# EAGLE design Sensor Acquisition Board Rev2 (EAGLE 9.6.2)
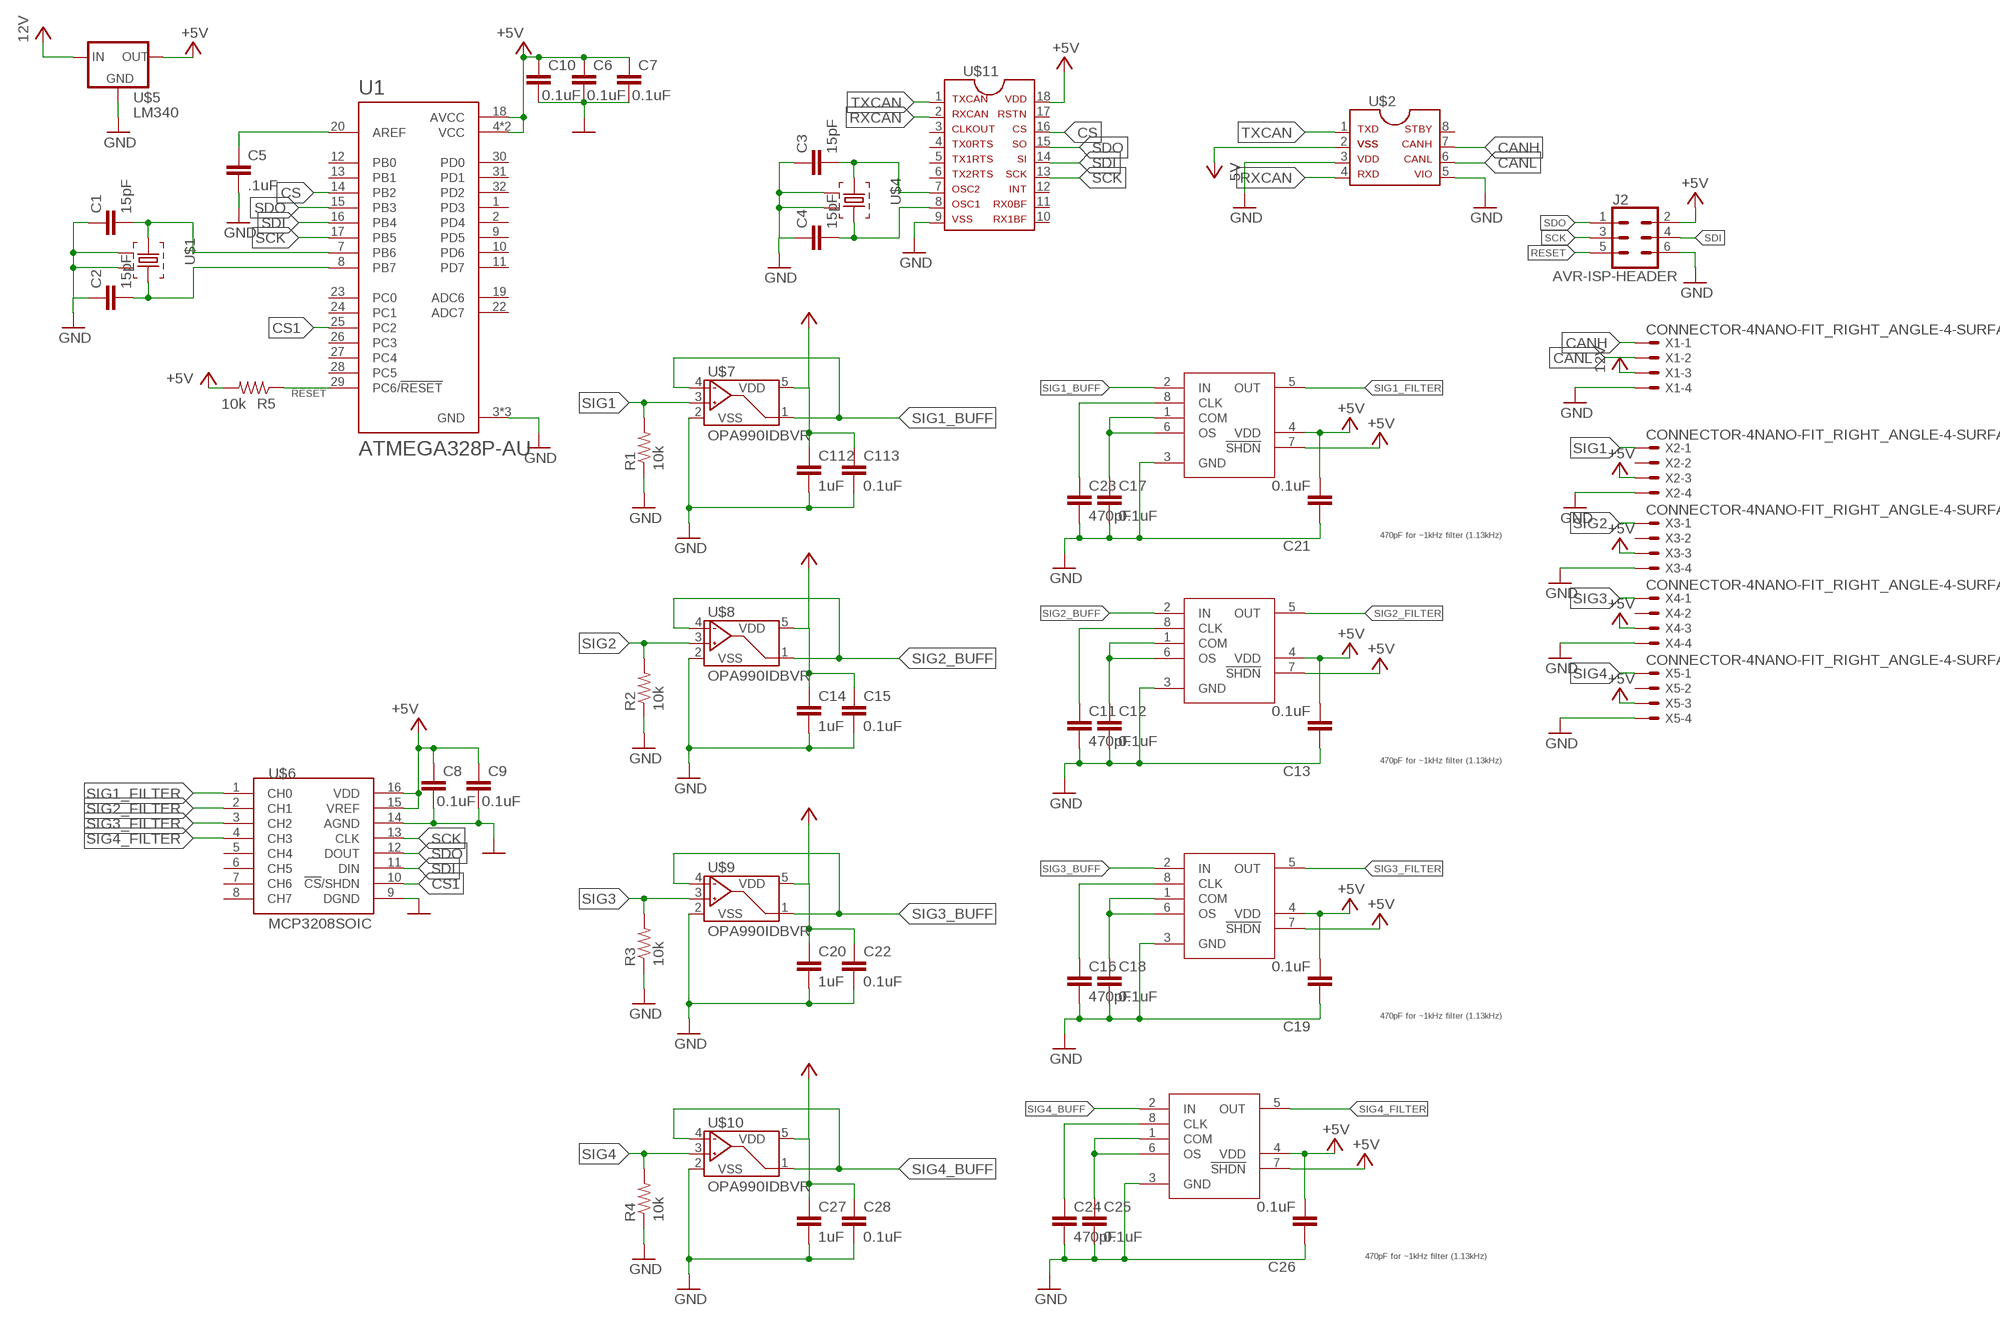
[diagram p0: schematic, sheet 1]

## Parts
C1  15pF  CAP0603-CAP  [0603-CAP]
C2  15pF  CAP0603-CAP  [0603-CAP]
C3  15pF  CAP0603-CAP  [0603-CAP]
C4  15pF  CAP0603-CAP  [0603-CAP]
C5  .1uF  CAP0603-CAP  [0603-CAP]
C6  0.1uF  CAP0603-CAP  [0603-CAP]
C7  0.1uF  CAP0603-CAP  [0603-CAP]
C8  0.1uF  CAP0603-CAP  [0603-CAP]
C9  0.1uF  CAP0603-CAP  [0603-CAP]
C10  0.1uF  CAP0603-CAP  [0603-CAP]
C11  470pF  CAP0603-CAP  [0603-CAP]
C12  0.1uF  CAP0603-CAP  [0603-CAP]
C13  0.1uF  CAP0603-CAP  [0603-CAP]
C14  1uF  CAP0603-CAP  [0603-CAP]
C15  0.1uF  CAP0603-CAP  [0603-CAP]
C16  470pF  CAP0603-CAP  [0603-CAP]
C17  0.1uF  CAP0603-CAP  [0603-CAP]
C18  0.1uF  CAP0603-CAP  [0603-CAP]
C19  0.1uF  CAP0603-CAP  [0603-CAP]
C20  1uF  CAP0603-CAP  [0603-CAP]
C21  0.1uF  CAP0603-CAP  [0603-CAP]
C22  0.1uF  CAP0603-CAP  [0603-CAP]
C23  470pF  CAP0603-CAP  [0603-CAP]
C24  470pF  CAP0603-CAP  [0603-CAP]
C25  0.1uF  CAP0603-CAP  [0603-CAP]
C26  0.1uF  CAP0603-CAP  [0603-CAP]
C27  1uF  CAP0603-CAP  [0603-CAP]
C28  0.1uF  CAP0603-CAP  [0603-CAP]
C112  1uF  CAP0603-CAP  [0603-CAP]
C113  0.1uF  CAP0603-CAP  [0603-CAP]
J2  AVR-ISP-HEADER  [2X03@1]
R1  10k  RESISTOR0603  [0603-RES]
R2  10k  RESISTOR0603  [0603-RES]
R3  10k  RESISTOR0603  [0603-RES]
R4  10k  RESISTOR0603  [0603-RES]
R5  10k  RESISTOR0603  [0603-RES]
U1  ATMEGA328P-AU  [QFP80P900X900X120-32N]
U2  MAX7480  MAX7400  [SOP8]
U3  MAX7480  MAX7400  [SOP8]
U4  MAX7480  MAX7400  [SOP8]
U24  MAX7480  MAX7400  [SOP8]
U$1  ABM3B  [ABM3B]
U$2  MCP2562FDSOIC-08  [SOIC-08]
U$4  ABM3B  [ABM3B]
U$5  LM340  [SOT223]
U$6  MCP3208SOIC  [SOIC-16]
U$7  OPA990IDBVR  [SOT-23-5]
U$8  OPA990IDBVR  [SOT-23-5]
U$9  OPA990IDBVR  [SOT-23-5]
U$10  OPA990IDBVR  [SOT-23-5]
U$11  MCP2515SMD  [SOIC-18W]
X1  CONNECTOR-4NANO-FIT_RIGHT_ANGLE-4-SURFACE  [NANO-FIT_RIGHT_ANGLE-4-SURFACE]
X2  CONNECTOR-4NANO-FIT_RIGHT_ANGLE-4-SURFACE  [NANO-FIT_RIGHT_ANGLE-4-SURFACE]
X3  CONNECTOR-4NANO-FIT_RIGHT_ANGLE-4-SURFACE  [NANO-FIT_RIGHT_ANGLE-4-SURFACE]
X4  CONNECTOR-4NANO-FIT_RIGHT_ANGLE-4-SURFACE  [NANO-FIT_RIGHT_ANGLE-4-SURFACE]
X5  CONNECTOR-4NANO-FIT_RIGHT_ANGLE-4-SURFACE  [NANO-FIT_RIGHT_ANGLE-4-SURFACE]

## Nets
+5V: C6.1 C7.1 C8.1 C9.1 C10.1 C13.2 C14.1 C15.1 C19.2 C20.1 C21.2 C22.1 C26.2 C27.1 C28.1 C112.1 C113.1 J2.2 R5.2 U1.4(VCC) U1.6(VCC) U1.18(AVCC) U2.4(VDD) U2.7(!SHDN) U3.4(VDD) U3.7(!SHDN) U4.4(VDD) U4.7(!SHDN) U24.4(VDD) U24.7(!SHDN) U$5.3(OUT) U$6.15(VREF) U$6.16(VDD) U$7.5(VDD) U$8.5(VDD) U$9.5(VDD) U$10.5(VDD) U$11.18(VDD) X2.3 X3.3 X4.3 X5.3
CANH: U$2.7 X1.1
CANL: U$2.6 X1.2
CS: U1.14(PB2) U$11.16(CS)
CS1: U1.25(PC2) U$6.10(!CS!/SHDN)
GND: C1.1 C2.1 C3.1 C4.1 C5.2 C6.2 C7.2 C8.2 C9.2 C10.2 C11.2 C12.2 C13.1 C14.2 C15.2 C16.2 C17.2 C18.2 C19.1 C20.2 C21.1 C22.2 C23.2 C24.2 C25.2 C26.1 C27.2 C28.2 C112.2 C113.2 J2.6 R1.1 R2.1 R3.1 R4.1 U1.3(GND) U1.5(GND) U1.21(GND) U2.3(GND) U3.3(GND) U4.3(GND) U24.3(GND) U$1.GND U$1.GND2 U$2.3 U$2.5 U$4.GND U$4.GND2 U$5.2(GND) U$5.4(GND) U$6.9(DGND) U$6.14(AGND) U$7.2(VSS) U$8.2(VSS) U$9.2(VSS) U$10.2(VSS) U$11.9(VSS) X1.4 X2.4 X3.4 X4.4 X5.4
N$1: C11.1 U2.8(CLK)
N$2: C1.2 U1.7(PB6) U$1.1
N$3: C2.2 U1.8(PB7) U$1.3
N$4: C3.2 U$4.1 U$11.7(OSC2)
N$5: C4.2 U$4.3 U$11.8(OSC1)
N$6: C12.1 U2.1(COM) U2.6(OS)
N$7: C16.1 U3.8(CLK)
N$8: C5.1 U1.20(AREF)
N$9: C18.1 U3.1(COM) U3.6(OS)
N$10: C24.1 U4.8(CLK)
N$11: C25.1 U4.1(COM) U4.6(OS)
N$13: C17.1 U24.1(COM) U24.6(OS)
N$14: C23.1 U24.8(CLK)
RESET: J2.5 R5.1 U1.29(PC6/!RESET)
RXCAN: U$2.4 U$11.2(RXCAN)
SCK: J2.3 U1.17(PB5) U$6.13(CLK) U$11.13(SCK)
SDI: J2.4 U1.16(PB4) U$6.11(DIN) U$11.14(SI)
SDO: J2.1 U1.15(PB3) U$6.12(DOUT) U$11.15(SO)
SIG1: R1.2 U$7.3(VIN+) X2.1
SIG1_BUFF: U24.2(IN) U$7.1(VOUT) U$7.4(VIN-)
SIG1_FILTER: U24.5(OUT) U$6.1(CH0)
SIG2: R2.2 U$8.3(VIN+) X3.1
SIG2_BUFF: U2.2(IN) U$8.1(VOUT) U$8.4(VIN-)
SIG2_FILTER: U2.5(OUT) U$6.2(CH1)
SIG3: R3.2 U$9.3(VIN+) X4.1
SIG3_BUFF: U3.2(IN) U$9.1(VOUT) U$9.4(VIN-)
SIG3_FILTER: U3.5(OUT) U$6.3(CH2)
SIG4: R4.2 U$10.3(VIN+) X5.1
SIG4_BUFF: U4.2(IN) U$10.1(VOUT) U$10.4(VIN-)
SIG4_FILTER: U4.5(OUT) U$6.4(CH3)
TXCAN: U$2.1 U$11.1(TXCAN)
VCC: U$2.2 U$5.1(IN) X1.3 ; supply symbol labelled 5V, 12V
Unconnected: U1.1(PD3) U1.2(PD4) U1.9(PD5) U1.10(PD6) U1.11(PD7) U1.12(PB0) U1.13(PB1) U1.19(ADC6) U1.22(ADC7) U1.23(PC0) U1.24(PC1) U1.26(PC3) U1.27(PC4) U1.28(PC5) U1.30(PD0) U1.31(PD1) U1.32(PD2) U$2.8 U$6.5(CH4) U$6.6(CH5) U$6.7(CH6) U$6.8(CH7) U$11.3(CLKOUT) U$11.4(TX0RTS) U$11.5(TX1RTS) U$11.6(TX2RTS) U$11.10(RX1BF) U$11.11(RX0BF) U$11.12(INT) U$11.17(RSTN) X2.2 X3.2 X4.2 X5.2

## Notes on the sheet
- 470pF for ~1kHz filter (1.13kHz)
- 470pF for ~1kHz filter (1.13kHz)
- 470pF for ~1kHz filter (1.13kHz)
- 470pF for ~1kHz filter (1.13kHz)

## Library data of the parts
C1-C28 C112 C113 = HyTechDevices:CAP: Capacitor Standard 0603 ceramic capacitor, and 0.1" leaded capacitor.
J2 = HyTechDevices:AVR-ISP-HEADER: AVR ISP 6-pin Header Reference <https://en.wikipedia.org/wiki/In-system_programming>; DIGIKEY: S2011EC-03-ND
R1-R5 = HyTechDevices:RESISTOR: Resistor Basic schematic elements and footprints for 0603, 1206, and PTH resistors.
U1 = HyTechDevices:ATMEGA328P-AU: ATmega Series 20 MHz 32 KB Flash 2 KB SRAM 8-Bit Microcontroller - TQFP-32; AVAILABILITY: Unavailable; DESCRIPTION: AVR AVR® ATmega Microcontroller IC 8-Bit 20MHz 32KB _16K x 16_ FLASH 32-TQFP _7x7_; MF: Microchip; MP: ATMEGA328P-AU; PACKAGE: TQFP-32 Microchip; PRICE: None
U2-U4 U24 = HyTechDevices:MAX7400: MAX7400 Elliptic Filter Datasheet <https://datasheets.maximintegrated.com/en/ds/MAX7400-MAX7407.pdf>
U$1 U$4 = HyTechDevices:ABM3B: ABM3B ceramic SMD crystal. Datasheet <https://www.mouser.com/datasheet/2/3/abm3b-39910.pdf>
U$2 = HyTechDevices:MCP2562FD: MCP2562FD High-speed CAN Transceiver Datatsheet <http://ww1.microchip.com/downloads/en/devicedoc/20005167c.pdf>
U$5 = HyTechDevices:LM340: LM340 7.5-35V to 5V SMD regulator Mouser link <https://www.mouser.com/ProductDetail/Texas-Instruments/LM340MPX-50-NOPB?qs=sGAEpiMZZMvu8NZDyZ4K0cQiG3JqdhEW>
U$6 = HyTechDevices:MCP3208: Analog to Digital Converter
U$7-U$10 = HyTechDevices:OPA990IDBVR: TI OPA990 20V Op-Amp Comparator Datasheet <https://www.ti.com/lit/ds/symlink/opa990.pdf>
U$11 = HyTechDevices:MCP2515: MCP2515 CAN Controller with SPI Interface Datasheet <http://ww1.microchip.com/downloads/en/DeviceDoc/21801G.pdf>
X1-X5 = HyTechDevices:CONNECTOR-4: Mini-Fit Junior connector 4 pole Source: http://www.molex.com

## Board
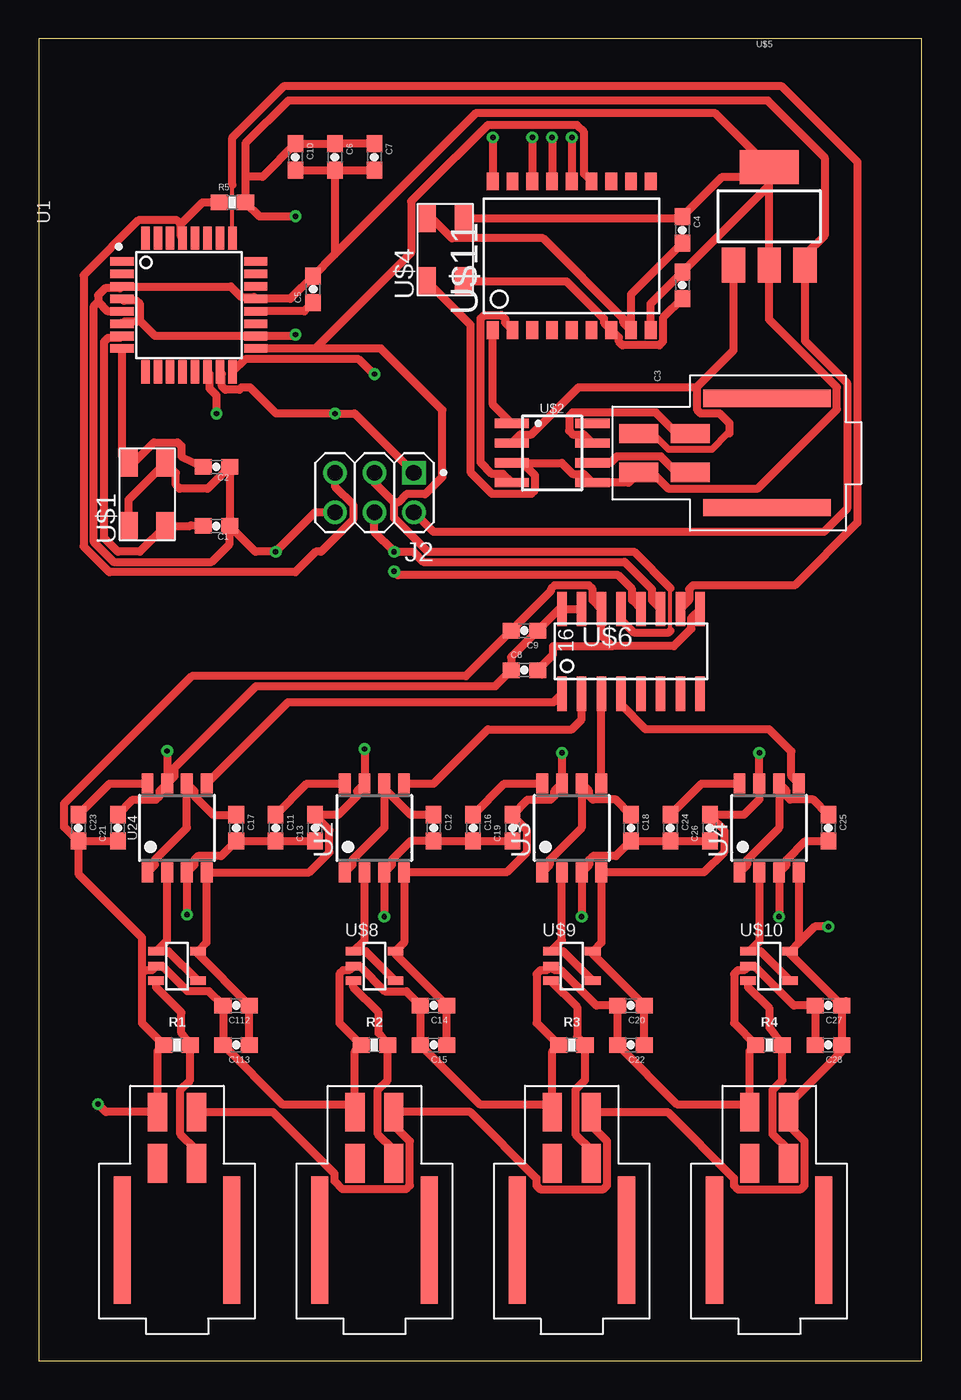
[diagram p1: board, top side]
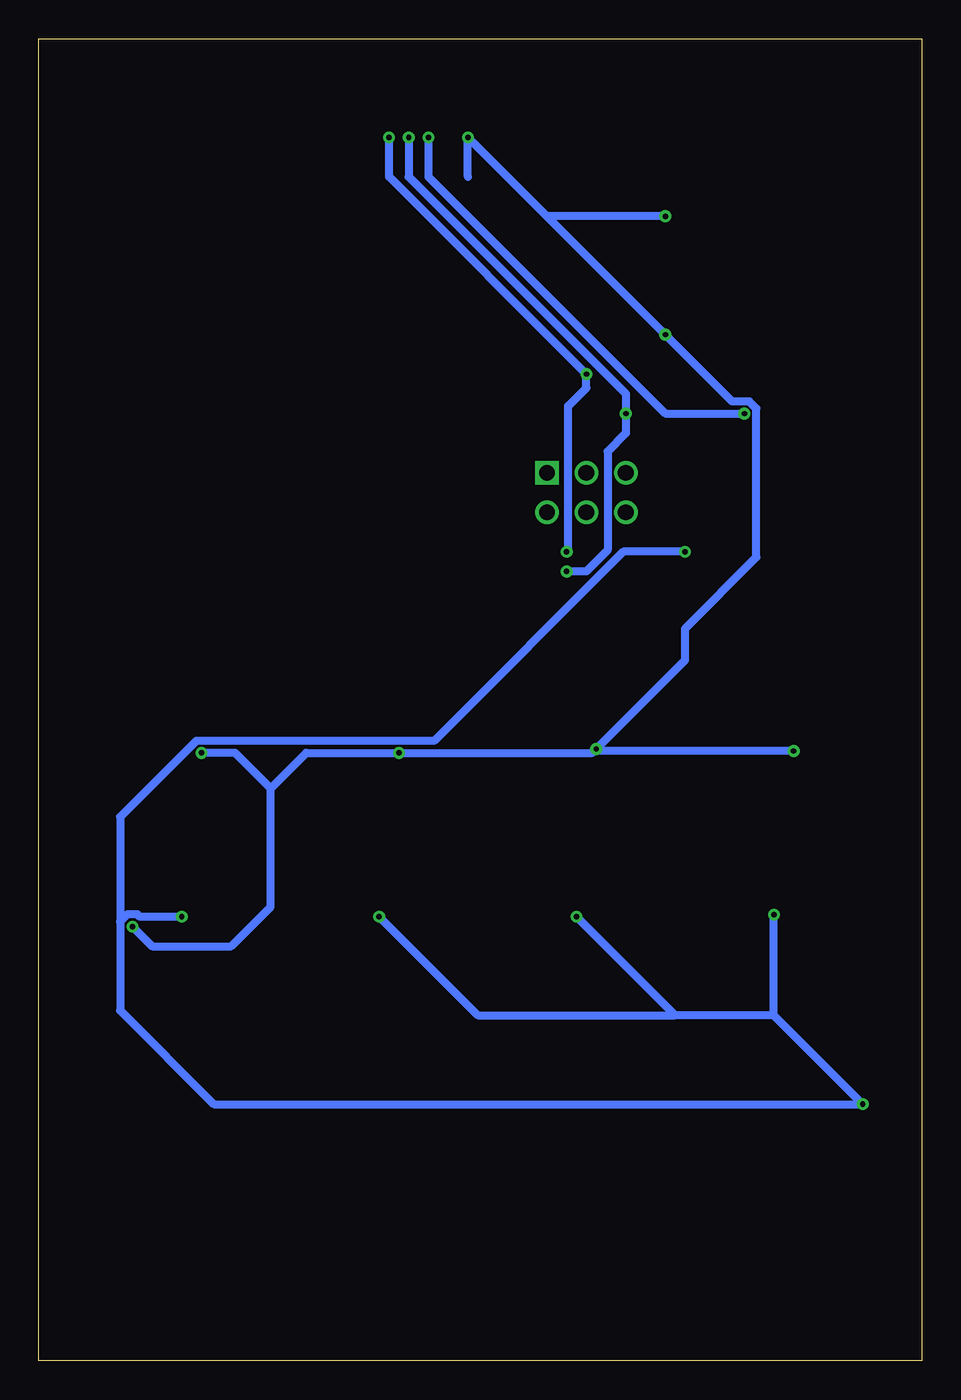
[diagram p2: board, bottom side, seen from below]

Size 56.82 x 85.08 mm. Coordinates in mm from the lower left corner, seen from the top.
Outline: 0,0 56.82,0 56.82,85.08 0,85.08 0,0
Copper layers (1*16): Top 0.035mm / dielectric 1.5mm / Bottom 0.035mm
Design rules "default": minimum track width 6mil, minimum drill 0.35mm, track to track 6mil, track to pad 6mil, pad to pad 6mil, via to via 6mil, smd to smd 6mil, copper to edge 40mil, drill to drill 6mil, minimum pad ring 10mil, minimum via ring 8mil, stop-mask expansion 4mil, vias tented up to drill 0mil, thermal gap 10mil

### Footprints (pad centres in the part's own frame; a part is rotated, then mirrored left to right if it is on the bottom)
0603-CAP = smd 1.1 x 1: 1 -0.85,0; 2 0.85,0
2X03@1 = drill 1.016 square: 1 -2.54,-1.27 | drill 1.016: 2 -2.54,1.27; 3 0,-1.27; 4 0,1.27; 5 2.54,-1.27; 6 2.54,1.27
0603-RES = smd 1.1 x 1: 1 -0.85,0; 2 0.85,0
QFP80P900X900X120-32N = smd 1.5 x 0.55: 1 -4.3,2.8; 2 -4.3,2; 3 -4.3,1.2; 4 -4.3,0.4; 5 -4.3,-0.4; 6 -4.3,-1.2; 7 -4.3,-2; 8 -4.3,-2.8; 17 4.3,-2.8; 18 4.3,-2; 19 4.3,-1.2; 20 4.3,-0.4; 21 4.3,0.4; 22 4.3,1.2; 23 4.3,2; 24 4.3,2.8 | smd 0.55 x 1.5: 9 -2.8,-4.3; 10 -2,-4.3; 11 -1.2,-4.3; 12 -0.4,-4.3; 13 0.4,-4.3; 14 1.2,-4.3; 15 2,-4.3; 16 2.8,-4.3; 25 2.8,4.3; 26 2,4.3; 27 1.2,4.3; 28 0.4,4.3; 29 -0.4,4.3; 30 -1.2,4.3; 31 -2,4.3; 32 -2.8,4.3
SOP8 = smd 0.76 x 1.27: 1 -1.905,-2.86; 2 -0.635,-2.86; 3 0.635,-2.86; 4 1.905,-2.86; 5 1.905,2.86; 6 0.635,2.86; 7 -0.635,2.86; 8 -1.905,2.86
ABM3B = smd 1.803 x 1.194: 1 0.902,0.597; 3 4.966,2.985; GND 0.902,2.985; GND2 4.966,0.597
SOIC-08 = smd 0.6 x 2.2: 1 -1.905,-2.6; 2 -0.635,-2.6; 3 0.635,-2.6; 4 1.905,-2.6; 5 1.905,2.6; 6 0.635,2.6; 7 -0.635,2.6; 8 -1.905,2.6
SOT223 = smd 1.5 x 2.235: 1 -2.3,-3.15; 2 0,-3.15; 3 2.3,-3.15 | smd 3.8 x 2.2: 4 0,3.15
SOIC-16 = smd 0.6 x 2.2: 1 -4.445,-2.794; 2 -3.175,-2.794; 3 -1.905,-2.794; 4 -0.635,-2.794; 5 0.635,-2.794; 6 1.905,-2.794; 7 3.175,-2.794; 8 4.445,-2.794; 9 4.445,2.667; 10 3.175,2.667; 11 1.905,2.667; 12 0.635,2.667; 13 -0.635,2.667; 14 -1.905,2.667; 15 -3.175,2.667; 16 -4.445,2.667
SOT-23-5 = smd 1 x 0.55: 1 -1.35,0.95; 2 -1.35,0; 3 -1.35,-0.95; 4 1.35,-0.95; 5 1.35,0.95
SOIC-18W = smd 0.762 x 1.143: 1 -5.08,-4.788; 2 -3.81,-4.788; 3 -2.54,-4.788; 4 -1.27,-4.788; 5 0,-4.788; 6 1.27,-4.788; 7 2.54,-4.788; 8 3.81,-4.788; 9 5.08,-4.788; 10 5.08,4.788; 11 3.81,4.788; 12 2.54,4.788; 13 1.27,4.788; 14 0,4.788; 15 -1.27,4.788; 16 -2.54,4.788; 17 -3.81,4.788; 18 -5.08,4.788
NANO-FIT_RIGHT_ANGLE-4-SURFACE = smd 1.24 x 2.5: 1 1.25,0; 2 -1.25,0; 3 1.25,3.3; 4 -1.25,3.3 | smd 1.1 x 8.2: P$5 -3.52,-4.93; P$6 3.52,-4.93

### Placement (x,y rotation side)
C1  11.43,53.72 180 top
C2  11.43,57.53 180 top
C3  41.4,69.22 270 top
C4  41.4,72.77 270 top
C5  17.65,68.96 90 top
C6  19.05,77.47 270 top
C7  21.59,77.47 270 top
C8  31.24,44.45 0 top
C9  31.24,46.99 180 top
C10  16.51,77.47 270 top
C11  15.24,34.29 270 top
C12  25.4,34.29 270 top
C13  17.78,34.29 90 top
C14  25.4,22.86 180 top
C15  25.4,20.32 180 top
C16  27.94,34.29 270 top
C17  12.7,34.29 270 top
C18  38.1,34.29 270 top
C19  30.48,34.29 90 top
C20  38.1,22.86 180 top
C21  5.08,34.29 90 top
C22  38.1,20.32 180 top
C23  2.54,34.29 270 top
C24  40.64,34.29 270 top
C25  50.8,34.29 270 top
C26  43.18,34.29 90 top
C27  50.8,22.86 180 top
C28  50.8,20.32 180 top
C112  12.7,22.86 180 top
C113  12.7,20.32 180 top
J2  21.59,55.88 180 top
R1  8.89,20.32 0 top
R2  21.59,20.32 0 top
R3  34.29,20.32 0 top
R4  46.99,20.32 0 top
R5  12.45,74.55 0 top
U1  9.65,67.94 0 top
U2  21.59,34.29 0 top
U3  34.29,34.29 0 top
U4  46.99,34.29 0 top
U24  8.89,34.29 0 top
U$1  8.76,52.83 90 top
U$2  33.02,58.42 270 top
U$4  27.94,68.58 90 top
U$5  46.99,73.66 0 top
U$6  38.1,45.72 0 top
U$7  8.89,25.4 0 top
U$8  21.59,25.4 0 top
U$9  34.29,25.4 0 top
U$10  46.99,25.4 0 top
U$11  34.29,71.12 0 top
X1  41.91,58.42 90 top
X2  8.89,12.7 0 top
X3  21.59,12.7 0 top
X4  34.29,12.7 0 top
X5  46.99,12.7 0 top

### Tracks (layer width: path | path; a pad name or v marks a point on that pad's centre or on a via)
+5V  (via drill 0.35)
  Top 0.508: U$6.15 U$6.16 33.49,48.39 C9.1 30.39,45.29 C8.1 29.37,43.43 29.37,43.41 13.97,43.41 8.74,38.17 8.74,37.63 U24.7 | 6.51,67.1 6.51,67.99 6.27,68.23 5.47,68.23 U1.4 | 26.17,20.32 C15.1 C14.1 22.94,26.17 U$8.5 23.49,26.91 U2.4 30.09,31.43 31.39,32.72 31.39,34.16 30.48,35.06 C19.2 31.45,36.11 32.93,36.11 33.17,36.35 33.17,36.67 U3.7 v33.66,39.12 | C7.1 C6.1 C10.1 14.39,76.2 13.3,76.2 | C113.1 C112.1 10.24,26.17 U$7.5 10.79,26.91 U24.4 17.4,31.43 18.69,32.72 18.69,34.16 17.78,35.06 C13.2 19.27,35.14 20.47,36.35 20.47,36.67 U2.7 v20.95,39.37 | C27.1 C28.1 51.65,19.92 48.24,16.51 X5.3 48.24,15.14 49.27,14.12 49.27,11.28 49.03,11.04 44.95,11.04 44.71,11.28 44.71,11.75 40.46,16 X4.3 35.54,15.14 36.57,14.12 36.57,11.28 36.33,11.04 32.25,11.04 32.01,11.28 32.01,11.75 27.77,16 X3.3 22.84,15.14 23.87,14.12 23.87,11.28 23.63,11.04 19.55,11.04 19.03,11.57 19.03,12.04 15.06,16 X2.3 | 6.51,67.1 6.27,66.86 5.47,66.86 U1.6 | J2.2 25.4,53.34 50.51,53.34 52.01,54.84 52.01,62.93 49.29,65.65 U$5.3 49.29,71.14 50.57,72.42 50.57,77.44 46.9,81.11 16.05,81.11 13.3,78.36 13.3,76.2 | 13.3,76.2 R5.2 14.19,73.66 v16.51,73.66 | 51.94,23.15 C27.1 | 6.51,67.1 6.51,66.92 7.49,65.94 U1.18 16.41,65.94 v16.51,66.04 | C21.2 6.05,36.11 7.53,36.11 7.77,36.35 7.77,36.67 U24.7 | U4.4 48.9,26.91 | 48.9,26.91 U$10.5 48.34,26.17 C27.1 | v50.8,27.94 49.93,27.94 48.9,26.91 | v46.35,39.12 U4.7 46.35,36.13 45.36,35.14 C26.2 43.18,35.06 44.09,34.16 44.09,32.72 42.8,31.43 U3.4 36.2,26.91 U$9.5 35.64,26.17 C20.1 C22.1 | v8.25,39.24 U24.7 | v29.21,78.74 U$11.18
  Bottom 0.508: 41.91,36.83 41.91,29.21 44.45,26.67 49.53,26.67 v50.8,27.94 | 29.21,76.2 v29.21,78.74 24.13,73.66 | 24.13,73.66 v16.51,66.04 12.21,61.74 11.11,61.74 10.64,61.28 10.64,51.71 15.24,47.12 15.24,45.09 v20.95,39.37 21.08,39.24 | 41.91,36.83 44.2,39.12 v46.35,39.12 | 41.91,36.83 39.62,39.12 v33.66,39.12 21.21,39.12 21.08,39.24 | v16.51,73.66 24.13,73.66 | v8.25,39.24 21.08,39.24
CANH
  Top 0.508: X1.1 41.05,59.67 39.69,61.03 34.35,61.03 34.11,60.79 34.11,59.86 34.35,59.62 35.06,59.62 U$2.7
CANL
  Top 0.508: X1.2 41.05,57.17 40.03,58.2 37.19,58.2 36.78,57.78 U$2.6
CS  (via drill 0.35)
  Top 0.508: U1.14 10.97,63.53 10.97,62.59 11.43,62.13 v11.43,60.96 | v31.75,78.74 U$11.16
  Bottom 0.508: v31.75,78.74 31.75,76.2 16.51,60.96 v11.43,60.96
CS1
  Top 0.254: U1.25 12.45,75.69
  Top 0.508: 12.45,75.69 12.45,78.72 15.75,82.03 47.81,82.03 52.67,77.17 52.67,54.61 52.67,54.57 52.67,53.94 48.62,49.89 42.08,49.89 41.84,49.66 41.84,48.95 U$6.10
GND  (via drill 0.35)
  Top 0.508: 46.99,75.65 U$5.2 46.99,67.02 51.35,62.66 51.35,61.22 46.27,56.14 40.49,56.14 39.46,57.17 X1.4 37.95,56.52 U$2.5 35.06,57.08 34.35,57.08 33.65,57.78 U$2.3 31.12,57.78 31.93,56.98 31.93,56.05 31.69,55.81 29.15,55.81 27.76,57.2 27.76,66.67 U$4.GND | 46.99,76.2 U$5.4 43.48,80.31 28.16,80.31 19.05,71.21 | C15.2 C14.2 23.64,23.77 22.27,23.77 20.64,25.4 U$8.2 19.97,25.13 19.57,25.13 19.33,24.89 19.33,21.73 R2.1 20.34,19.92 20.34,16.51 | C28.2 C27.2 48.58,22.86 46.04,25.4 U$10.2 45.37,25.13 44.97,25.13 44.73,24.89 44.73,21.73 R4.1 45.74,19.92 45.74,16.51 | C113.2 C112.2 10.94,23.77 9.57,23.77 7.94,25.4 U$7.2 7.27,25.13 6.87,25.13 6.63,24.89 | C6.2 C7.2 | U1.5 5.33,67.57 4.4,67.57 3.81,68.15 | U$1.GND 5.78,55.41 U$1.GND2 8.82,57.14 8.82,56.36 9.06,56.12 10.85,56.12 12.26,57.53 C2.1 C1.1 | X4.4 33.04,16.51 | 33.04,16.51 33.04,19.92 R3.1 32.03,21.73 32.03,24.89 32.27,25.13 32.67,25.13 U$9.2 33.21,25.13 33.61,25.13 35.88,22.86 C20.2 C22.2 | X5.4 45.74,16.51 | X3.4 20.34,16.51 | 32.39,44.15 C8.2 33.09,45.45 33.09,45.99 36.87,45.99 | 3.81,68.15 3.81,68.58 4.26,69.03 5.23,69.03 U1.3 12.35,69.14 13.03,68.46 13.83,68.46 U1.21 16.19,68.34 C5.2 19.05,71.21 | 3.81,68.15 3.54,67.88 3.54,52.68 4.81,51.41 11.11,51.41 12.28,52.57 C1.1 | U$6.9 41.98,47.82 41.98,47.12 40.85,45.99 36.87,45.99 | 36.87,45.99 36.2,46.67 U$6.14 35.63,48.95 35.63,49.66 35.39,49.89 33.19,49.89 32.95,49.66 32.95,49.55 C9.2 27.47,44.07 9.84,44.07 1.63,35.86 1.63,34.35 C23.2 | C13.1 C11.2 C17.2 11.73,32.47 10.25,32.47 10.01,32.23 10.01,31.91 U24.3 v9.52,28.7 | C19.1 C16.2 C12.2 23.91,33.44 22.71,32.23 22.71,31.91 U2.3 v22.23,28.57
  Top 0.508: C26.1 C24.2 C18.2 37.13,32.47 35.65,32.47 35.41,32.23 35.41,31.91 U3.3 v34.92,28.57 | C25.2 49.32,33.44 48.11,32.23 48.11,31.91 U4.3 v47.62,28.57 | U$4.GND2 41.33,73.55 C4.1 43.98,76.2 46.99,76.2 | 46.99,75.65 C3.1 39.37,68.03 U$11.9 | 46.99,75.65 46.99,76.2 | J2.6 17.78,54.61 v15.24,52.07 13.93,52.07 C1.1 | C22.2 37.33,20.32 | 6.63,24.89 6.63,21.73 R1.1 7.64,19.92 X2.4 4.32,16 v3.81,16.51 | 6.63,24.89 6.63,27.24 2.54,31.33 C23.2 | C113.2 11.92,20.32 | C15.2 24.62,20.32 | 2.54,33.52 C23.2 | C10.2 C6.2 | C6.2 19.05,71.21 | C113.2 15.66,16.51 20.34,16.51 | C15.2 28.36,16.51 33.04,16.51 | C22.2 41.06,16.51 45.74,16.51 | C23.2 C21.1
  Bottom 0.508: 51.59,28.27 51.12,28.73 50.48,28.73 50.32,28.57 v47.62,28.57 | 51.59,28.27 51.59,22.54 45.56,16.51 v3.81,16.51 9.52,22.23 | 9.52,22.23 v9.52,28.7 | v22.23,28.57 15.88,22.23 | v34.92,28.57 28.58,22.23 15.88,22.23 | v15.24,52.07 19.21,52.07 31.38,39.9 46.68,39.9 51.59,35 51.59,28.27 | 9.52,22.23 15.88,22.23
N$1
  Top 0.508: C11.1 17.25,37.15 U2.8
N$2
  Top 0.508: C1.2 9.77,53.78 9.73,53.73 U$1.1 6.5,52.07 5.08,52.07 4.2,52.95 4.2,65.59 4.43,65.83 5.23,65.83 U1.7
N$3
  Top 0.508: C2.2 9.17,58.19 9.17,58.87 8.93,59.11 7.4,59.11 6.09,57.8 U$1.3 5.35,58.22 U1.8
N$4
  Top 0.508: U$4.1 33.94,69.48 36.35,67.07 36.35,66.81 U$11.7 37.31,65.85 37.31,65.59 37.55,65.35 39.92,65.35 40.16,65.59 40.16,67.12 C3.2
N$5
  Top 0.508: U$4.3 25.27,73.55 26.58,72.24 32.45,72.24 37.62,67.07 37.62,66.81 U$11.8 38.1,68.62 C4.2
N$6
  Top 0.508: U2.1 20.17,31.91 20.17,32.23 22.23,34.29 22.23,36.83 | U2.6 22.23,36.83 | C12.1 23.91,35.14 22.23,36.83
N$7
  Top 0.508: C16.1 29.95,37.15 U3.8
N$8
  Top 0.508: C5.1 17.09,67.55 U1.20
N$9
  Top 0.508: U3.1 32.87,31.91 32.87,32.23 34.92,34.29 U3.6 35.41,36.67 35.41,36.35 35.65,36.11 37.13,36.11 C18.1
N$10
  Top 0.508: C24.1 42.65,37.15 U4.8
N$11
  Top 0.508: U4.1 45.57,31.91 45.57,32.23 47.62,34.29 U4.6 48.11,36.67 48.11,36.35 48.35,36.11 49.83,36.11 C25.1
N$13
  Top 0.508: U24.1 7.47,31.91 7.47,32.23 9.52,34.29 U24.6 10.01,36.67 10.01,36.35 11.21,35.14 C17.1
N$14
  Top 0.508: C23.1 4.55,37.15 U24.8
RESET
  Top 0.508: 9.13,73.16 8.89,73.4 6.41,73.4 2.88,69.87 2.88,52.41 4.53,50.75 16.51,50.75 17.83,52.07 18.16,52.07 20.22,54.13 20.22,55.09 19.05,56.26 J2.5 | U1.29 9.13,72.36 9.13,73.16 | R5.1 10.52,74.55 9.13,73.16
RXCAN
  Top 0.508: U$2.4 29.86,57.08 29.15,57.08 28.42,57.81 28.42,67.07 28.66,67.31 29.76,67.31 30,67.07 30,66.81 U$11.2
SCK
  Top 0.254: 40.64,46.99 40.64,49.73
  Top 0.508: U$6.13 37.46,47.68 38.27,46.88 40.53,46.88 40.64,46.99 | 22.86,55.24 21.59,56.52 J2.3 | 22.86,55.24 22.86,54.23 25.02,52.07 38.3,52.07 40.64,49.73 | 22.86,55.24 23.11,55.24 23.65,55.78 24.86,55.78 25.96,56.88 25.96,61.2 22.01,65.14 17.78,65.14 | 17.78,65.14 U1.17 | U$11.13 35.08,76.39 35.08,79.06 34.62,79.53 28.88,79.53 26.83,77.47 26.81,77.47 23.95,74.62 23.95,71.32 17.78,65.14
SDI  (via drill 0.35)
  Top 0.508: U1.16 13.27,64.46 20.58,64.46 21.54,63.5 v21.59,63.5 | U$6.11 39.44,48.95 39.44,49.53 39.44,49.66 37.69,51.41 24.74,51.41 24.08,52.07 v22.86,52.07 21.59,53.34 J2.4 | v34.29,78.74 U$11.14
  Bottom 0.508: v22.86,52.07 22.76,52.17 22.76,61.44 21.59,62.61 v21.59,63.5 34.29,76.2 v34.29,78.74
SDO  (via drill 0.35)
  Top 0.508: U$6.12 38.17,48.95 38.17,49.66 37.27,50.55 23.11,50.55 v22.86,50.8 | J2.1 20.32,60.96 v19.05,60.96 15.27,60.96 13.59,62.64 13.04,62.64 12.9,62.49 12.01,62.49 11.77,62.73 11.77,63.53 U1.15 | v33.02,78.74 U$11.15
  Bottom 0.508: v33.02,78.74 33.02,76.2 19.05,62.23 v19.05,60.96 19.05,59.69 20.22,58.52 20.22,52.17 21.59,50.8 v22.86,50.8
SIG1
  Top 0.508: U$7.3 7.54,24.03 9.17,22.41 9.17,21.09 R1.2 9.74,18.05 9.11,17.42 9.11,14.58 10.14,13.55 X2.1
SIG1_BUFF
  Top 0.508: U$7.4 8.34,26.35 U$7.1 8.25,27.07 U24.2
SIG1_FILTER
  Top 0.508: U$6.1 33.12,42.39 16.03,42.39 U24.5
SIG2
  Top 0.508: U$8.3 20.24,24.03 21.87,22.41 21.87,21.09 R2.2 22.44,18.05 21.81,17.42 21.81,14.58 22.84,13.55 X3.1
SIG2_BUFF
  Top 0.508: U$8.4 21.04,26.35 U$8.1 20.95,27.07 U2.2
SIG2_FILTER
  Top 0.508: U2.5 25.4,37.15 28.89,40.64 34.29,40.64 34.92,41.27 U$6.2
SIG3
  Top 0.508: X4.1 35.54,13.55 34.51,14.58 34.51,17.42 35.14,18.05 R3.2 34.63,20.83 34.63,22.76 U$9.3
SIG3_BUFF
  Top 0.508: U$9.4 33.74,26.35 U$9.1 33.66,27.07 U3.2
SIG3_FILTER
  Top 0.508: U3.5 U$6.3
SIG4
  Top 0.508: U$10.3 45.64,24.03 47.01,22.66 47.01,21.43 R4.2 47.84,18.05 47.21,17.42 47.21,14.58 48.24,13.55 X5.1
SIG4_BUFF
  Top 0.508: U$10.4 46.44,26.35 45.72,26.35 | 45.72,26.35 U$10.1 | U4.2 46.35,26.98 45.72,26.35
SIG4_FILTER
  Top 0.508: U4.5 48.41,37.63 48.41,39.22 46.99,40.64 39.05,40.64 37.46,42.22 U$6.4
TXCAN
  Top 0.508: U$2.1 29.21,61.53 U$11.1
VCC
  Top 0.457: 44.45,59.69 44.34,59.69 43.32,58.67 40.5,58.67 39.5,59.67 X1.3
  Top 0.508: 44.45,59.69 44.45,60.33 43.79,60.98 42.57,60.98 42.33,61.22 42.33,62.66 | U$5.1 44.69,65.02 42.33,62.66 | U$2.2 30.98,59.62 31.69,59.62 34.73,62.66 42.33,62.66